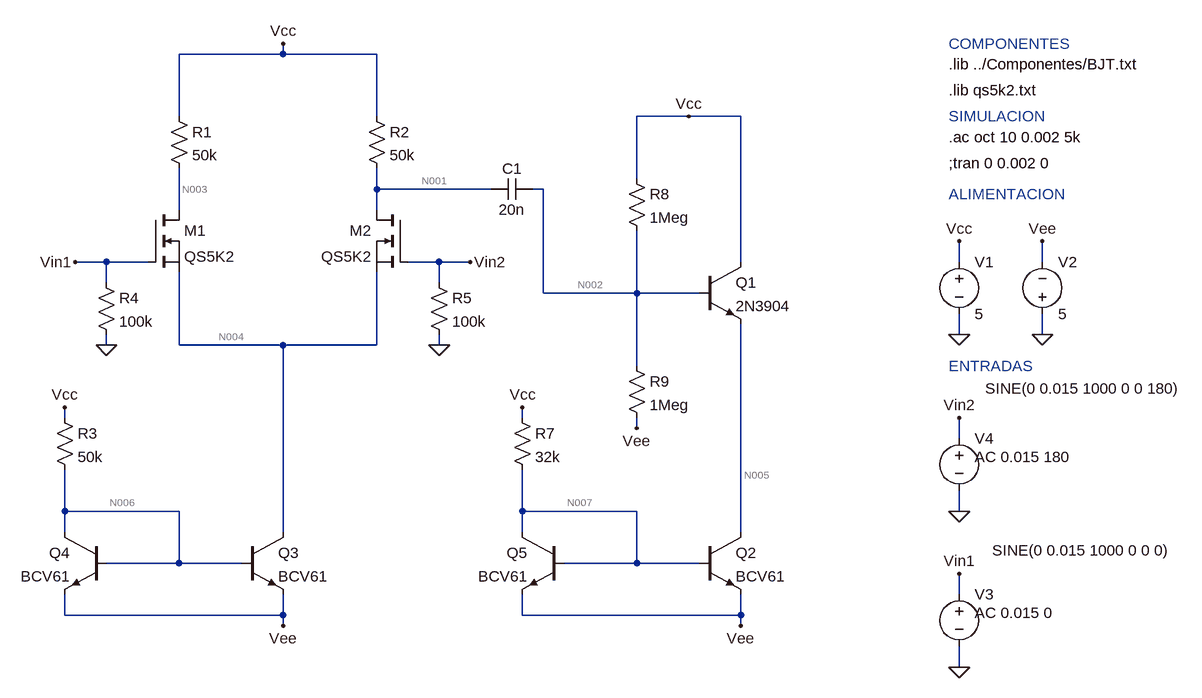
[diagram p0: schematic Emiter_follower.asc]
Emiter_follower.asc, the LTspice schematic file:
Version 4
SHEET 1 1252 872
WIRE -384 -224 -384 -240
WIRE -384 -224 -544 -224
WIRE -240 -224 -384 -224
WIRE -544 -176 -544 -224
WIRE -240 -176 -240 -224
WIRE -544 -128 -544 -176
WIRE -240 -128 -240 -176
WIRE 240 -128 160 -128
WIRE 320 -128 240 -128
WIRE 160 -32 160 -128
WIRE -240 -16 -240 -48
WIRE -64 -16 -240 -16
WIRE 16 -16 0 -16
WIRE -544 16 -544 -48
WIRE -240 16 -240 -16
WIRE -656 96 -704 96
WIRE -592 96 -656 96
WIRE -144 96 -192 96
WIRE -96 96 -144 96
WIRE 320 96 320 -128
WIRE 656 96 656 64
WIRE 784 96 784 64
WIRE -656 128 -656 96
WIRE -144 128 -144 96
WIRE 16 144 16 -16
WIRE 160 144 160 48
WIRE 160 144 16 144
WIRE 256 144 160 144
WIRE 656 208 656 176
WIRE 784 208 784 176
WIRE -656 224 -656 208
WIRE -544 224 -544 112
WIRE -384 224 -544 224
WIRE -240 224 -240 112
WIRE -240 224 -384 224
WIRE -144 224 -144 208
WIRE 160 256 160 144
WIRE -720 336 -720 320
WIRE -384 336 -384 224
WIRE -16 336 -16 320
WIRE 320 336 320 192
WIRE 160 352 160 336
WIRE 656 368 656 336
WIRE -720 448 -720 416
WIRE -16 448 -16 416
WIRE -720 480 -720 448
WIRE -544 480 -720 480
WIRE -16 480 -16 448
WIRE 160 480 -16 480
WIRE 656 480 656 448
WIRE -720 512 -720 480
WIRE -384 512 -384 336
WIRE -16 512 -16 480
WIRE 320 512 320 336
WIRE -544 560 -544 480
WIRE -544 560 -656 560
WIRE -448 560 -544 560
WIRE 160 560 160 480
WIRE 160 560 48 560
WIRE 256 560 160 560
WIRE 656 608 656 576
WIRE -720 640 -720 608
WIRE -384 640 -384 608
WIRE -384 640 -720 640
WIRE -16 640 -16 608
WIRE 320 640 320 608
WIRE 320 640 -16 640
WIRE -384 656 -384 640
WIRE 320 656 320 640
WIRE 656 720 656 688
FLAG 656 208 0
FLAG 784 208 0
FLAG 656 64 Vcc
FLAG 784 64 Vee
FLAG -384 -240 Vcc
FLAG 656 480 0
FLAG 656 720 0
FLAG -384 656 Vee
FLAG -720 320 Vcc
FLAG -704 96 Vin1
FLAG 656 336 Vin2
FLAG 656 576 Vin1
FLAG -96 96 Vin2
FLAG -656 224 0
FLAG -144 224 0
FLAG 320 656 Vee
FLAG -16 320 Vcc
FLAG 240 -128 Vcc
FLAG 160 352 Vee
DATAFLAG -384 336 "Ic(Q3)"
DATAFLAG -544 -176 "I(R1)"
DATAFLAG -240 -176 "I(R2)"
DATAFLAG -720 448 "I(R3)"
DATAFLAG 320 336 "Ic(Q3)"
DATAFLAG -16 448 "I(R3)"
SYMBOL voltage 656 80 R0
WINDOW 123 0 0 Left 2
WINDOW 39 0 0 Left 2
SYMATTR InstName V1
SYMATTR Value 5
SYMBOL voltage 784 192 M180
WINDOW 0 24 96 Left 2
WINDOW 3 24 16 Left 2
WINDOW 123 0 0 Left 2
WINDOW 39 0 0 Left 2
SYMATTR InstName V2
SYMATTR Value 5
SYMBOL voltage 656 592 R0
WINDOW 3 51 -52 Left 2
WINDOW 123 24 44 Left 2
WINDOW 39 63 45 Left 2
SYMATTR Value SINE(0 0.015 1000 0 0 0)
SYMATTR Value2 AC 0.015 0
SYMATTR InstName V3
SYMBOL voltage 656 352 R0
WINDOW 3 40 -61 Left 2
WINDOW 123 24 44 Left 2
WINDOW 39 63 46 Left 2
SYMATTR Value SINE(0 0.015 1000 0 0 180)
SYMATTR Value2 AC 0.015 180
SYMATTR InstName V4
SYMBOL npn -448 512 R0
SYMATTR InstName Q3
SYMATTR Value BCV61
SYMBOL npn -656 512 M0
SYMATTR InstName Q4
SYMATTR Value BCV61
SYMBOL res -736 320 R0
SYMATTR InstName R3
SYMATTR Value 50k
SYMBOL nmos -592 16 R0
SYMATTR InstName M1
SYMATTR Value QS5K2
SYMATTR Prefix X
SYMBOL nmos -192 16 M0
SYMATTR InstName M2
SYMATTR Value QS5K2
SYMATTR Prefix X
SYMBOL res -560 -144 R0
SYMATTR InstName R1
SYMATTR Value 50k
SYMBOL res -256 -144 R0
SYMATTR InstName R2
SYMATTR Value 50k
SYMBOL res -672 112 R0
SYMATTR InstName R4
SYMATTR Value 100k
SYMBOL res -160 112 R0
SYMATTR InstName R5
SYMATTR Value 100k
SYMBOL cap 0 -32 R90
WINDOW 0 0 32 VBottom 2
WINDOW 3 32 32 VTop 2
SYMATTR InstName C1
SYMATTR Value 20n
SYMBOL npn 256 96 R0
SYMATTR InstName Q1
SYMATTR Value 2N3904
SYMBOL npn 256 512 R0
SYMATTR InstName Q2
SYMATTR Value BCV61
SYMBOL npn 48 512 M0
SYMATTR InstName Q5
SYMATTR Value BCV61
SYMBOL res -32 320 R0
SYMATTR InstName R7
SYMATTR Value 32k
SYMBOL res 144 -48 R0
SYMATTR InstName R8
SYMATTR Value 1Meg
SYMBOL res 144 240 R0
SYMATTR InstName R9
SYMATTR Value 1Meg
TEXT 640 -208 Left 2 !.lib ../Componentes/BJT.txt
TEXT 640 -168 Left 2 !.lib qs5k2.txt
TEXT 640 -240 Left 2 ;COMPONENTES
TEXT 640 -128 Left 2 ;SIMULACION
TEXT 640 -8 Left 2 ;ALIMENTACION
TEXT 640 256 Left 2 ;ENTRADAS
TEXT 640 -56 Left 2 !;tran 0 0.002 0
TEXT 640 -96 Left 2 !.ac oct 10 0.002 5k

The netlist it stands for:
* Emiter_follower.asc
V1 Vcc 0 5
V2 0 Vee 5
V3 Vin1 0 SINE(0 0.015 1000 0 0 0) AC 0.015 0
V4 Vin2 0 SINE(0 0.015 1000 0 0 180) AC 0.015 180
Q3 N004 N006 Vee 0 BCV61
Q4 N006 N006 Vee 0 BCV61
R3 Vcc N006 50k
XM1 N003 Vin1 N004 QS5K2  ; pins D G S
XM2 N001 Vin2 N004 QS5K2  ; pins D G S
R1 Vcc N003 50k
R2 Vcc N001 50k
R4 Vin1 0 100k
R5 Vin2 0 100k
C1 N002 N001 20n
Q1 Vcc N002 N005 0 2N3904
Q2 N005 N007 Vee 0 BCV61
Q5 N007 N007 Vee 0 BCV61
R7 Vcc N007 32k
R8 Vcc N002 1Meg
R9 N002 Vee 1Meg
.model NPN NPN
.model PNP PNP
.lib standard.bjt
.lib ../Componentes/BJT.txt
.lib qs5k2.txt
* COMPONENTES
* SIMULACION
* ALIMENTACION
* ENTRADAS
;tran 0 0.002 0
.ac oct 10 0.002 5k
.backanno
.end

* Results of the author's LTspice run, read from the files saved beside the schematic
* Operating Point, zero values left out:
*   V(vcc) = 5 V
*   V(vee) = -5 V
*   V(n004) = -934.8 mV
*   V(n006) = -4.407 V
*   V(n003) = 123 mV
*   V(n001) = 123 mV
*   V(n002) = -478.8 mV
*   V(n005) = -1.102 V
*   V(n007) = -4.395 V
*   Ic(Q1) = 302.8 µA
*   Ib(Q1) = 957.6 nA
*   Ie(Q1) = -303.8 µA
*   Ic(Q5) = 291.7 µA
*   Ib(Q5) = 938.4 nA
*   Ie(Q5) = -292.7 µA
*   Ic(Q2) = 303.8 µA
*   Ib(Q2) = 938.1 nA
*   Ie(Q2) = -304.7 µA
*   Ic(Q4) = 186.9 µA
*   Ib(Q4) = 600.8 nA
*   Ie(Q4) = -187.5 µA
*   Ic(Q3) = 195.1 µA
*   Ib(Q3) = 600.7 nA
*   Ie(Q3) = -195.7 µA
*   I(R9) = 4.521 µA
*   I(R8) = 5.479 µA
*   I(R7) = 293.6 µA
*   I(R2) = 97.54 µA
*   I(R1) = 97.54 µA
*   I(R3) = 188.1 µA
*   I(V2) = -985.1 µA
*   I(V1) = -985.1 µA
*   Ix(m1:1) = 97.54 µA
*   Ix(m1:3) = -97.54 µA
*   Ix(m2:1) = 97.54 µA
*   Ix(m2:3) = -97.54 µA
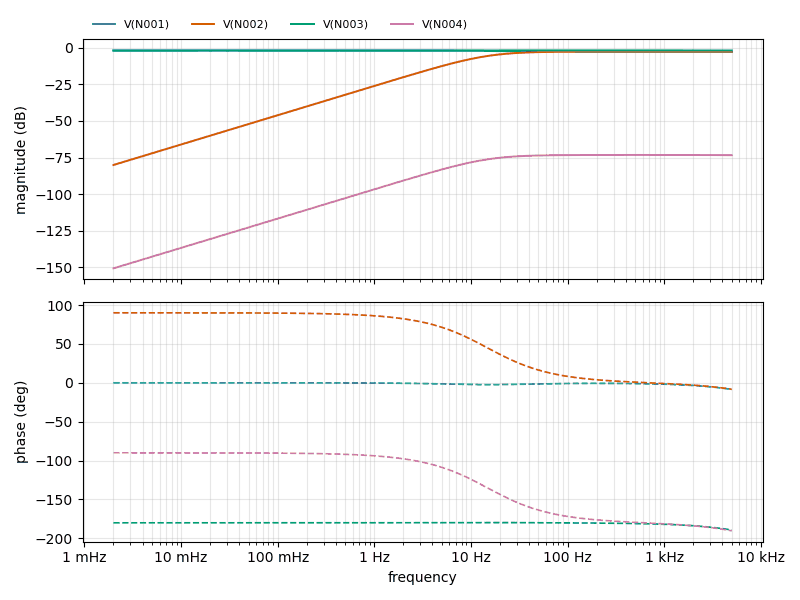
[diagram p1: AC Analysis of Emiter_follower.asc, plotted from the saved traces]
* AC Analysis, 1 run:
*   V(N001): -1.98 dB at 2 mHz, -2.78 dB at 5 kHz, peak -1.98 dB at 2 mHz
*   V(N002): -80.09 dB at 2 mHz, -2.79 dB at 5 kHz, peak -2.70 dB at 691.8 Hz, 3 dB below the peak at 14.81 Hz
*   V(N003): -1.98 dB at 2 mHz, -1.97 dB at 5 kHz, peak -1.86 dB at 281 Hz
*   V(N004): -150.63 dB at 2 mHz, -73.40 dB at 5 kHz, peak -73.24 dB at 602.2 Hz, 3 dB below the peak at 14.81 Hz